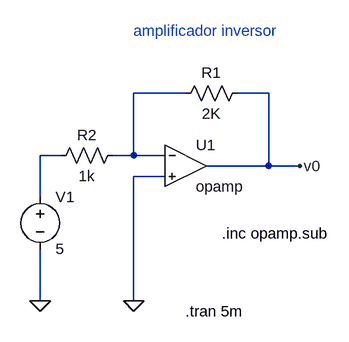
[diagram p0: schematic opampInversor.asc]
opampInversor.asc, the LTspice schematic file:
Version 4
SHEET 1 880 680
WIRE 416 192 336 192
WIRE 544 192 496 192
WIRE 224 288 192 288
WIRE 336 288 336 192
WIRE 336 288 304 288
WIRE 384 288 336 288
WIRE 544 304 544 192
WIRE 544 304 448 304
WIRE 592 304 544 304
WIRE 384 320 336 320
WIRE 192 352 192 288
WIRE 192 512 192 432
WIRE 336 512 336 320
FLAG 336 512 0
FLAG 192 512 0
FLAG 592 304 v0
SYMBOL Res 400 208 R270
WINDOW 0 32 56 VTop 2
WINDOW 3 0 56 VBottom 2
SYMATTR InstName R1
SYMATTR Value 2K
SYMBOL Voltage 192 336 R0
SYMATTR InstName V1
SYMATTR Value 5
SYMBOL Res 208 304 R270
WINDOW 0 32 56 VTop 2
WINDOW 3 0 56 VBottom 2
SYMATTR InstName R2
SYMATTR Value 1k
SYMBOL OpAmps/opamp 416 240 R0
SYMATTR InstName U1
TEXT 472 408 Left 2 !.inc opamp.sub
TEXT 416 528 Left 2 !.tran 5m
TEXT 336 96 Left 2 ;amplificador inversor

The netlist it stands for:
* opampInversor.asc
R1 N001 v0 2K
V1 N002 0 5
R2 N002 N001 1k
XU1 N001 0 v0 opamp Aol=100K GBW=10Meg  ; pins invin noninvin out
.inc opamp.sub
.tran 5m
* amplificador inversor
.backanno
.end